# EAGLE design ESP8266-ESP201 (EAGLE 7.6.0)
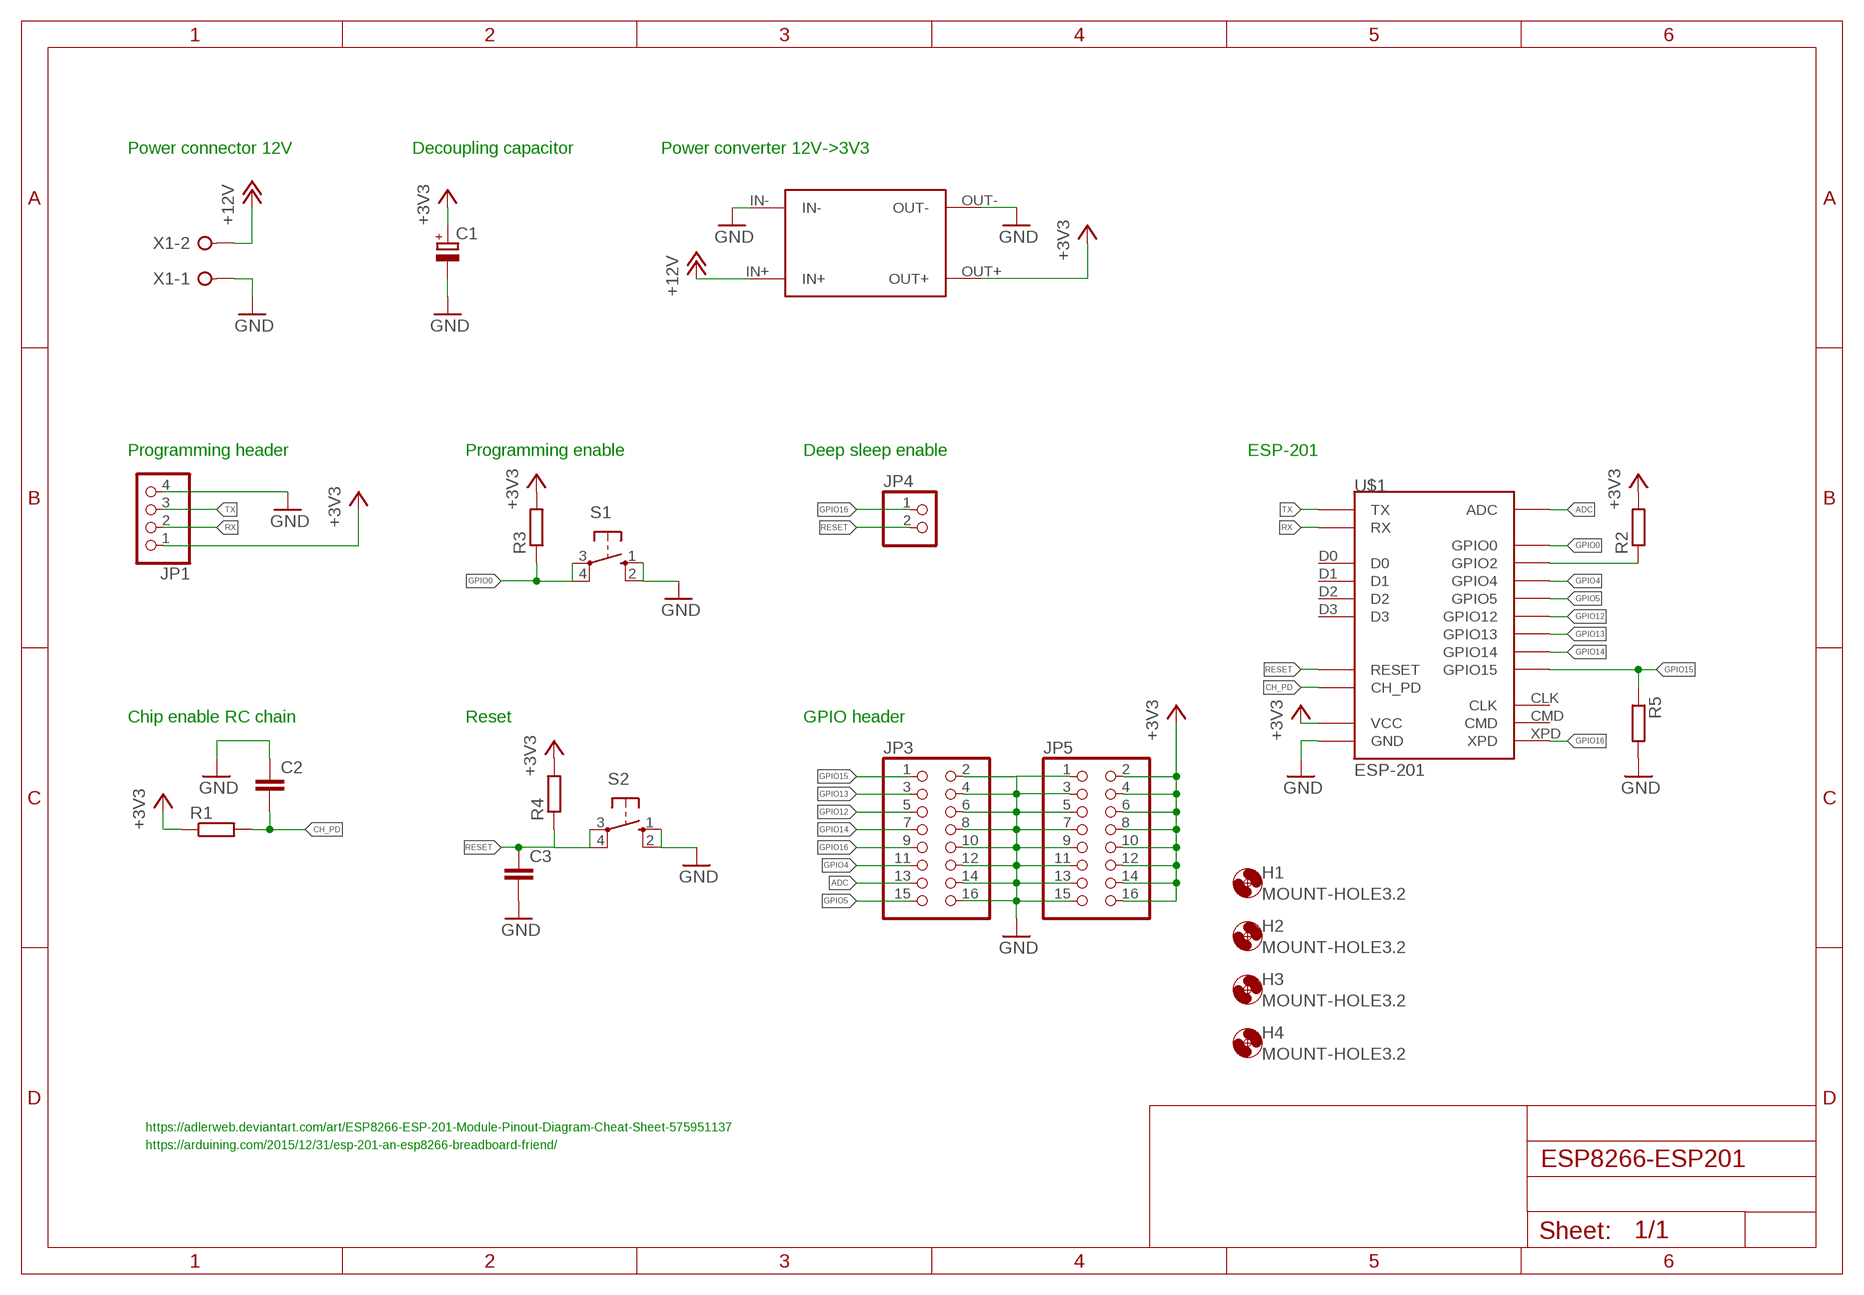
[diagram p0: schematic, sheet 1]

## Parts
C1  CPOL-EUE2.5-5  [E2,5-5]
C2  C-EU025-024X044  [C025-024X044]
C3  C-EU025-024X044  [C025-024X044]
H1  MOUNT-HOLE3.2  [3,2]
H2  MOUNT-HOLE3.2  [3,2]
H3  MOUNT-HOLE3.2  [3,2]
H4  MOUNT-HOLE3.2  [3,2]
JP1  PINHD-1X4  [1X04]
JP3  PINHD-2X8  [2X08]
JP4  PINHD-1X2  [1X02]
JP5  PINHD-2X8  [2X08]
R1  R-EU_0207/10  [0207/10]
R2  R-EU_0207/10  [0207/10]
R3  R-EU_0207/10  [0207/10]
R4  R-EU_0207/10  [0207/10]
R5  R-EU_0207/10  [0207/10]
S1  10-XX  [B3F-10XX]
S2  10-XX  [B3F-10XX]
U$1  ESP-201  [ESP-201]
U$2  MINI360  [MINI360]
X1  W237-02P  [W237-132]

## Nets
+3V3: C1.+ JP1.1 JP5.2 JP5.4 JP5.6 JP5.8 JP5.10 JP5.12 JP5.14 JP5.16 R1.1 R2.2 R3.2 R4.2 U$1.3V3(VCC) U$1.3V3_2(VCC) U$1.3V3_3(VCC) U$2.OUT+
+12V: U$2.IN+ X1.2
ADC: JP3.13 U$1.ADC
CH_PD: C2.2 R1.2 U$1.CH_PD
GND: C1.- C2.1 C3.2 JP1.4 JP3.2 JP3.4 JP3.6 JP3.8 JP3.10 JP3.12 JP3.14 JP3.16 JP5.1 JP5.3 JP5.5 JP5.7 JP5.9 JP5.11 JP5.13 JP5.15 R5.2 S1.1(S) S1.2(S1) S2.1(S) S2.2(S1) U$1.GND U$1.GND_2(GND) U$1.GND_3(GND) U$2.IN- U$2.OUT- X1.1
GPIO0: R3.1 S1.3(P) S1.4(P1) U$1.GPIO0
GPIO2: R2.1 U$1.GPIO2
GPIO4: JP3.11 U$1.GPIO4
GPIO5: JP3.15 U$1.GPIO5
GPIO12: JP3.5 U$1.GPIO12
GPIO13: JP3.3 U$1.GPIO13
GPIO14: JP3.7 U$1.GPIO14
GPIO15: JP3.1 R5.1 U$1.GPIO15
GPIO16: JP3.9 JP4.1 U$1.XPD
RESET: C3.1 JP4.2 R4.1 S2.3(P) S2.4(P1) U$1.RST(RESET)
RX: JP1.2 U$1.RX
TX: JP1.3 U$1.TX
Unconnected: U$1.CLK U$1.CMD U$1.D0 U$1.D1 U$1.D2 U$1.D3

## Notes on the sheet
- Power connector 12V | Decoupling capacitor | Power converter 12V->3V3
- Programming header | Programming enable | Deep sleep enable | ESP-201
- Chip enable RC chain | Reset | GPIO header
- https://adlerweb.deviantart.com/art/ESP8266-ESP-201-Module-Pinout-Diagram-Cheat-Sheet-575951137
- https://arduining.com/2015/12/31/esp-201-an-esp8266-breadboard-friend/

## Library data of the parts
C1 = resistor:CPOL-EU: POLARIZED CAPACITOR, European symbol
C2 C3 = resistor:C-EU: CAPACITOR, European symbol
H1-H4 = holes:MOUNT-HOLE: MOUNTING HOLE with drill center marker
JP1 = pinhead:PINHD-1X4: PIN HEADER
JP3 JP5 = pinhead:PINHD-2X8: PIN HEADER
JP4 = pinhead:PINHD-1X2: PIN HEADER
R1-R5 = resistor:R-EU_: RESISTOR, European symbol
S1 S2 = switch-omron:10-XX: OMRON SWITCH; MPN: B3F-1000; OC_FARNELL: 176432; OC_NEWARK: 36M3542
U$1 = esp8266modules:ESP-201: ESP8266 Wifi Module ESP-201; DIMENSIONS: 25 x 35 mm; PINS: 26; PITCH: 0.1" / 2.54 mm
U$2 = mini360:MINI360
X1 = con-wago-508:W237-02P: WAGO SREW CLAMP; OC_FARNELL: unknown; OC_NEWARK: unknown

## Board
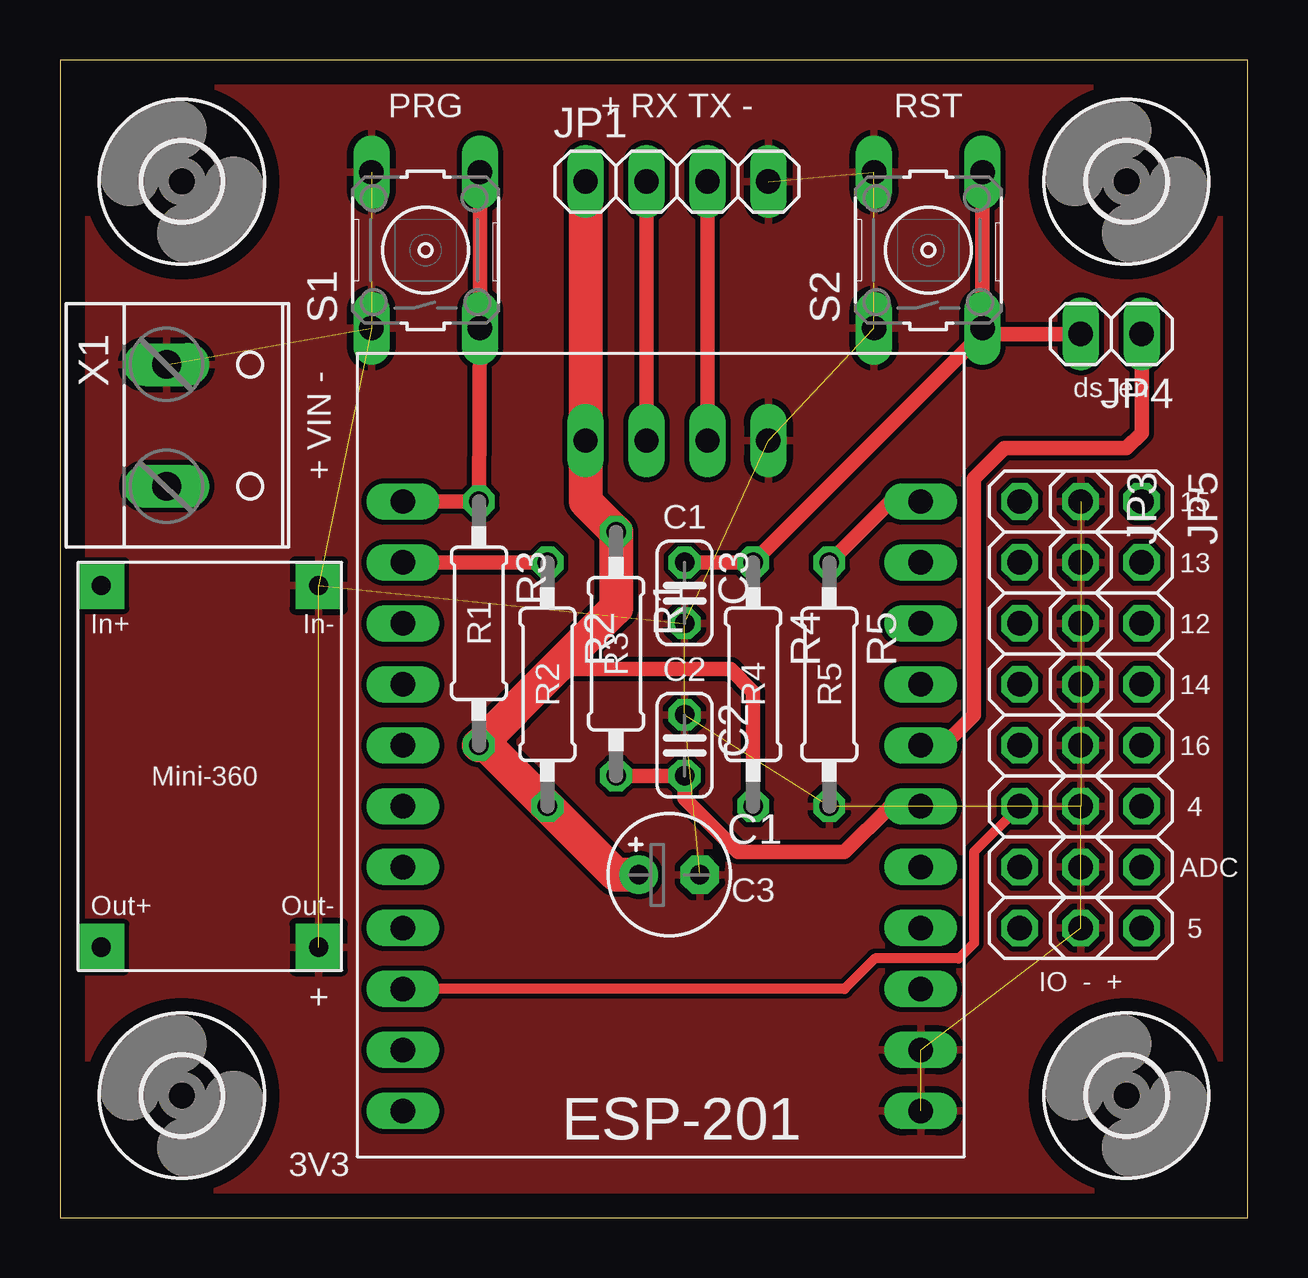
[diagram p1: board, top side]
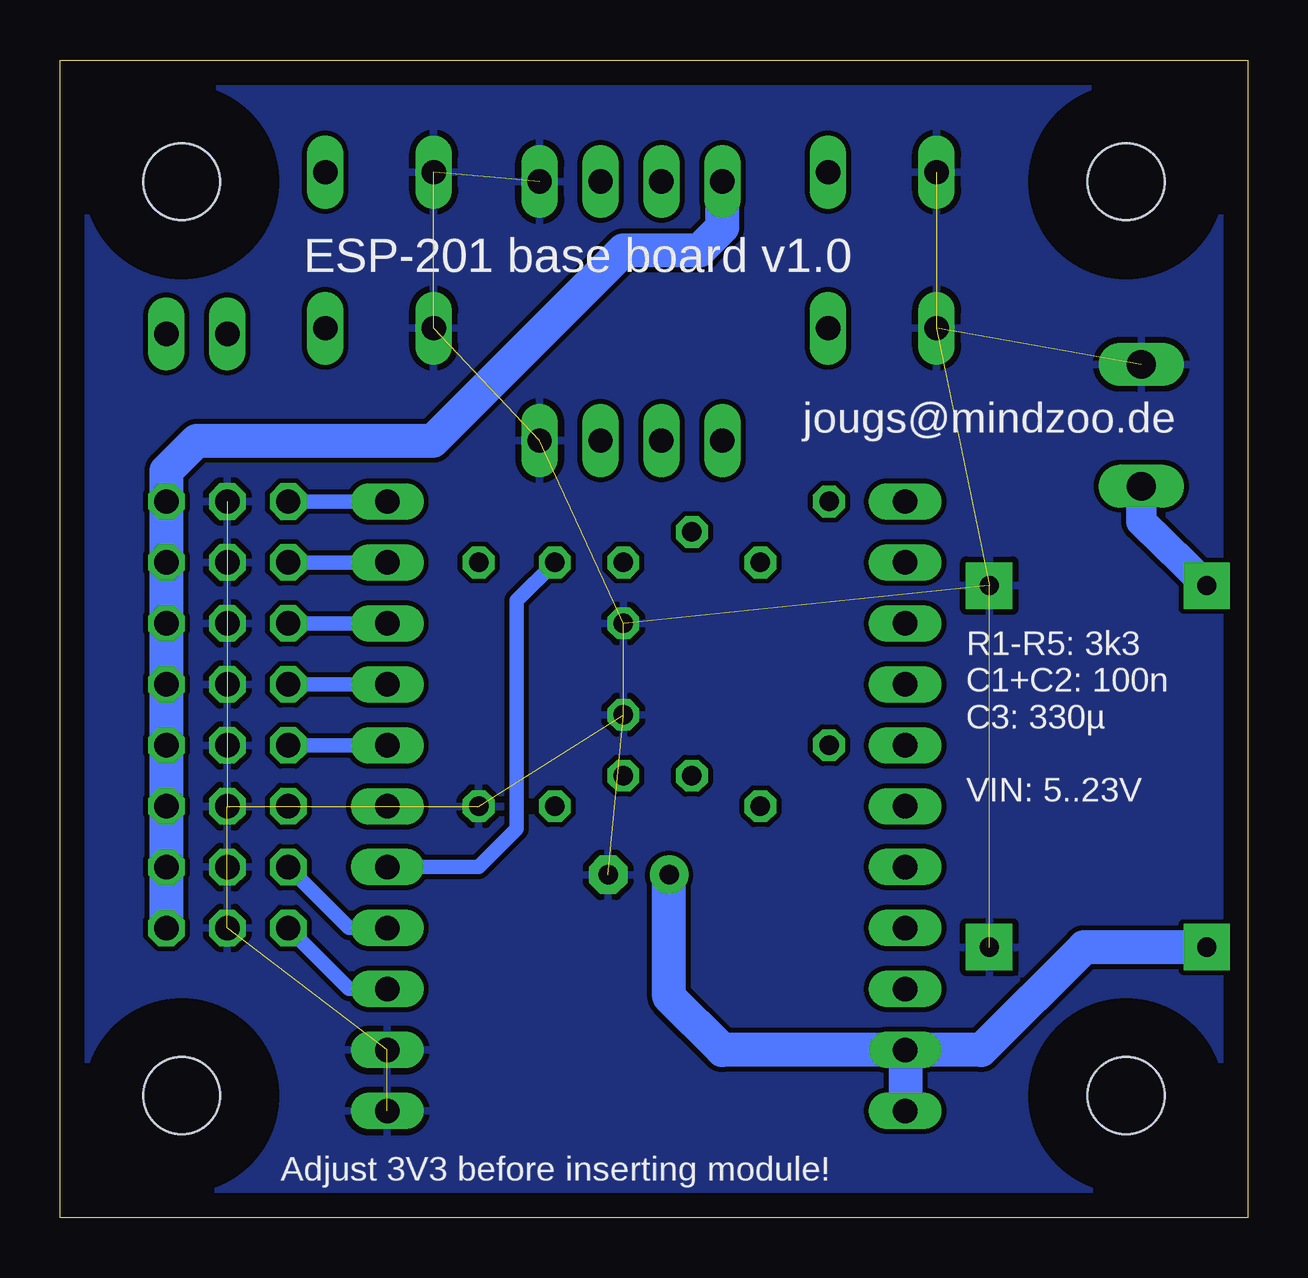
[diagram p2: board, bottom side, seen from below]

Size 49.52 x 48.25 mm. Coordinates in mm from the lower left corner, seen from the top.
Outline: 0,0 49.52,0 49.52,48.25 0,48.25 0,0
Copper layers (1*16): Top 0.035mm / dielectric 1.5mm / Bottom 0.035mm
Design rules "default": minimum track width 10mil, minimum drill 24mil, track to track 8mil, track to pad 8mil, pad to pad 8mil, via to via 8mil, smd to smd 8mil, copper to edge 40mil, drill to drill 8mil, minimum pad ring 10mil, minimum via ring 8mil, stop-mask expansion 4mil, vias tented up to drill 0mil, thermal gap 10mil

### Footprints (pad centres in the part's own frame; a part is rotated, then mirrored left to right if it is on the bottom)
E2,5-5 = drill 0.813 pad 1.6: + -1.27,0 | drill 0.813 pad 1.6 octagon: - 1.27,0
C025-024X044 = drill 0.813 octagon: 1 -1.27,0; 2 1.27,0
3,2 = hole 3.2: 0,0
1X04 = drill 1.016 long: 1 -3.81,0; 2 -1.27,0; 3 1.27,0; 4 3.81,0
2X08 = drill 1.016 octagon: 1 -8.89,-1.27; 2 -8.89,1.27; 3 -6.35,-1.27; 4 -6.35,1.27; 5 -3.81,-1.27; 6 -3.81,1.27; 7 -1.27,-1.27; 8 -1.27,1.27; 9 1.27,-1.27; 10 1.27,1.27; 11 3.81,-1.27; 12 3.81,1.27; 13 6.35,-1.27; 14 6.35,1.27; 15 8.89,-1.27; 16 8.89,1.27
1X02 = drill 1.016 long: 1 -1.27,0; 2 1.27,0
0207/10 = drill 0.813 octagon: 1 -5.08,0; 2 5.08,0
B3F-10XX = drill 1.016 long: 1 -3.251,2.261; 2 3.251,2.261; 3 -3.251,-2.261; 4 3.251,-2.261
ESP-201 = drill 1.016 long: 3V3 0,2.54; 3V3_2 0,0; 3V3_3 7.62,27.94; ADC 21.59,7.62; CH_PD 21.59,12.7; CLK 0,17.78; CMD 0,15.24; D0 0,12.7; D1 0,10.16; D2 0,20.32; D3 0,7.62; GND 21.59,2.54; GND_2 21.59,0; GND_3 15.24,27.94; GPIO0 0,25.4; GPIO2 0,22.86; GPIO4 0,5.08; GPIO5 21.59,5.08; GPIO12 21.59,20.32; GPIO13 21.59,22.86; GPIO14 21.59,17.78; GPIO15 21.59,25.4; RST 21.59,10.16; RX 10.16,27.94; TX 12.7,27.94; XPD 21.59,15.24
MINI360 = drill 0.8 pad 1.93 square: IN+ 10.035,0.965; IN- 0.965,0.965; OUT+ 10.035,16.035; OUT- 0.965,16.035
W237-132 = drill 1.194 long: 1 -2.54,-0.635; 2 2.54,-0.635

### Placement (x,y rotation side)
C1  25.4,14.29 0 top
C2  26.04,19.68 270 top
C3  26.04,26.04 270 top
H1  5.08,5.08 270 top
H2  44.45,5.08 270 top
H3  44.45,43.18 270 top
H4  5.08,43.18 270 top
JP1  25.72,43.18 0 top
JP3  41.27,20.95 270 top
JP4  43.81,36.83 180 top
JP5  43.81,20.95 270 top
R1  23.18,23.5 270 top
R2  20.32,22.23 270 top
R3  17.46,24.77 270 top
R4  28.89,22.23 270 top
R5  32.07,22.23 270 top
S1  15.24,40.32 90 top
S2  36.2,40.32 90 top
U$1  14.29,4.45 0 top
U$2  11.75,27.3 180 top
X1  5.08,33.02 270 top

### Tracks (layer width: path | path; a pad name or v marks a point on that pad's centre or on a via)
+3V3
  Top 0.61: R3.2 17.78,19.68 | R4.2 28.89,21.91 27.94,22.86 20.64,22.86 20.48,22.7
  Top 1.422: C1.+ 23.18,14.29 R2.2 17.78,19.68 | JP1.1 U$1.3V3_3 21.91,29.84 R1.1 23.18,25.4 20.48,22.7 R3.2
  Bottom 1.422: U$1.3V3 U$1.3V3_2 | JP5.16 JP5.14 JP5.12 JP5.10 JP5.8 JP5.6 JP5.4 JP5.2 45.09,31.11 43.81,32.38 33.97,32.38 26.04,40.32 22.86,40.32 21.91,41.27 JP1.1 | U$2.OUT+ 6.83,11.27 11.11,6.99 U$1.3V3 | U$1.3V3 21.91,6.99 24.13,9.21 C1.+
+12V
  Bottom 1.27: U$2.IN+ 4.45,29 X1.2
ADC
  Bottom 0.61: U$1.ADC 37.47,12.06 JP3.13
CH_PD
  Top 0.61: R1.2 C2.2 26.04,17.46 28.26,15.24 32.7,15.24 34.61,17.14 U$1.CH_PD
GND  (22 unrouted)
  pour Bottom: 0,48.26 49.53,48.26 49.53,0 0,0
  pour Top: -1.27,48.26 49.53,48.26 49.53,0 0,0
GPIO0
  Top 0.61: 17.5,37.43 S1.4 | U$1.GPIO0 R3.1 17.5,37.43 | S1.3 17.5,37.43
GPIO2
  Top 0.61: U$1.GPIO2 R2.1
GPIO4
  Top 0.406: JP3.11 38.1,15.24 38.1,11.43 37.47,10.79 33.97,10.79 32.7,9.53 U$1.GPIO4
GPIO5
  Bottom 0.61: U$1.GPIO5 37.47,9.53 JP3.15
GPIO12
  Bottom 0.61: U$1.GPIO12 JP3.5
GPIO13
  Bottom 0.61: U$1.GPIO13 JP3.3
GPIO14
  Bottom 0.61: U$1.GPIO14 JP3.7
GPIO15
  Top 0.61: U$1.GPIO15 34.61,29.84 R5.1
  Bottom 0.61: U$1.GPIO15 JP3.1
GPIO16
  Top 0.61: JP4.1 45.09,32.7 44.45,32.07 39.37,32.07 38.1,30.8 38.1,20.95 36.83,19.68 U$1.XPD
  Bottom 0.61: U$1.XPD JP3.9
RESET
  Top 0.61: 38.46,37.15 S2.4 | C3.1 R4.1 38.46,36.87 S2.3 38.46,37.15 | JP4.2 38.77,36.83 38.46,37.15
  Bottom 0.61: R4.1 30.48,25.72 30.48,16.19 32.07,14.61 U$1.RST
RX
  Top 0.61: JP1.2 U$1.RX
TX
  Top 0.61: JP1.3 U$1.TX

### Text on the board
tPlace: PRG | + RX TX - | RST | ds_en | + VIN - | 15 | C1 | 13 | R1 | 12 | R3 | C2 | R2 | R4 | R5 | 14 | 16 | 4 | ADC | C3 | 5 | IO - + | + | 3V3
bPlace: ESP-201 base board v1.0 | jougs@mindzoo.de | R1-R5: 3k3 / C1+C2: 100n / C3: 330µ / / VIN: 5..23V | Adjust 3V3 before inserting module!